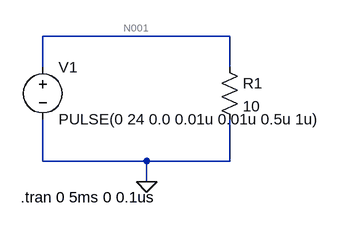
[diagram p0: schematic Draft1.asc]
Draft1.asc, the LTspice schematic file:
Version 4
SHEET 1 880 680
WIRE 336 80 48 80
WIRE 48 128 48 80
WIRE 336 128 336 80
WIRE 48 272 48 208
WIRE 208 272 48 272
WIRE 336 272 336 208
WIRE 336 272 208 272
WIRE 208 304 208 272
FLAG 208 304 0
SYMBOL voltage 48 112 R0
WINDOW 123 0 0 Left 2
WINDOW 39 0 0 Left 2
SYMATTR InstName V1
SYMATTR Value PULSE(0 24 0.0 0.01u 0.01u 0.5u 1u)
SYMBOL res 320 112 R0
SYMATTR InstName R1
SYMATTR Value 10
TEXT 14 328 Left 2 !.tran 0 5ms 0 0.1us

The netlist it stands for:
* Draft1.asc
V1 N001 0 PULSE(0 24 0.0 0.01u 0.01u 0.5u 1u)
R1 N001 0 10
.tran 0 5ms 0 0.1us
.backanno
.end

* Results of the author's LTspice run, read from the files saved beside the schematic
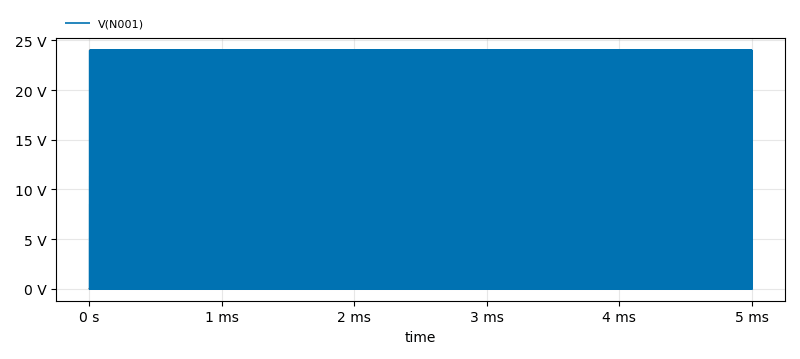
[diagram p1: Transient Analysis of Draft1.asc, plotted from the saved traces]
* Transient Analysis, 1 run:
*   V(N001): min 0 V, max 24 V, average 12.24 V, rms 17.14 V, last 0 V